# EAGLE design BinaryKeyboard (EAGLE 8.2.2)
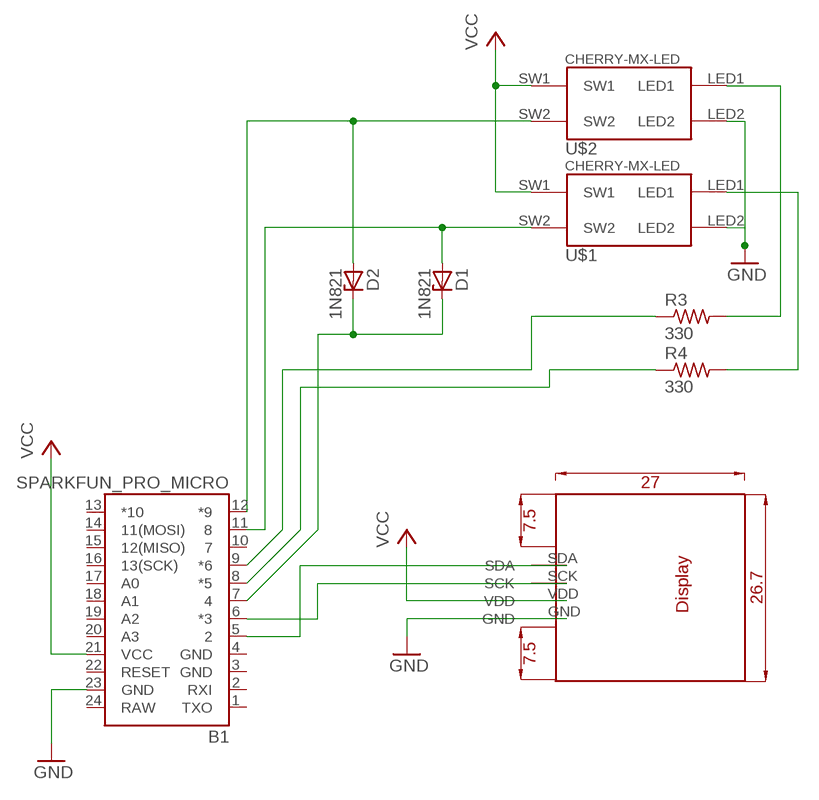
[diagram p0: schematic, sheet 1]

## Parts
B1  SPARKFUN_PRO_MICRO  [SPARKFUN_PRO_MICRO]
D1  1N821  [DO35Z10]
D2  1N821  [DO35Z10]
DISPLAY1  GM009605  [GM009605]
R3  330  R-US_0204/7  [0204/7]
R4  330  R-US_0204/7  [0204/7]
U$1  CHERRY-MX-LED  [CHERRY-MX-LED]
U$2  CHERRY-MX-LED  [CHERRY-MX-LED]

## Nets
GND: B1.23(GND) DISPLAY1.GND U$1.LED2 U$2.LED2
N$1: B1.11 D1.A U$1.SW2
N$2: B1.12(*9) D2.A U$2.SW2
N$3: B1.5 DISPLAY1.SDA
N$4: B1.6(*3) DISPLAY1.SCK
N$5: R3.2 U$2.LED1
N$6: R4.2 U$1.LED1
N$7: B1.9(*6) R3.1
N$8: B1.8(*5) R4.1
N$9: B1.7 D1.C D2.C
VCC: B1.21(VCC) DISPLAY1.VDD U$1.SW1 U$2.SW1
Unconnected: B1.1(TXO) B1.2(RXI) B1.10 B1.13(*10) B1.14(11(MOSI)) B1.15(12(MISO)) B1.16(13(SCK)) B1.17(A0) B1.18(A1) B1.19(A2) B1.20(A3) B1.22(RESET)

## Power pins joined to a net without a drawn wire
GND: B1.3(GND) B1.4(GND)
RAW: B1.24(RAW)

## Library data of the parts
B1 = SparkFun-Boards:SPARKFUN_PRO_MICRO: SparkFun Pro Micro Atmega32U4 compatible footprint. SparkFun Products: 3.3V/8MHz <https://www.sparkfun.com/products/12587> 5V/16MHz <https://www.sparkfun.com/products/12640>
D1 D2 = diode:1N821: Reference DIODE temperature compensated, 6,2 V
DISPLAY1 = CSJ Library:GM009605: GM009605 OLED Display
R3 R4 = resistor:R-US_: RESISTOR, American symbol
U$1 U$2 = cherrymx:CHERRY-MX-LED: Cherry MX series keyswitch with LED

## Net classes
0 default: width 0.305 mm

## Board
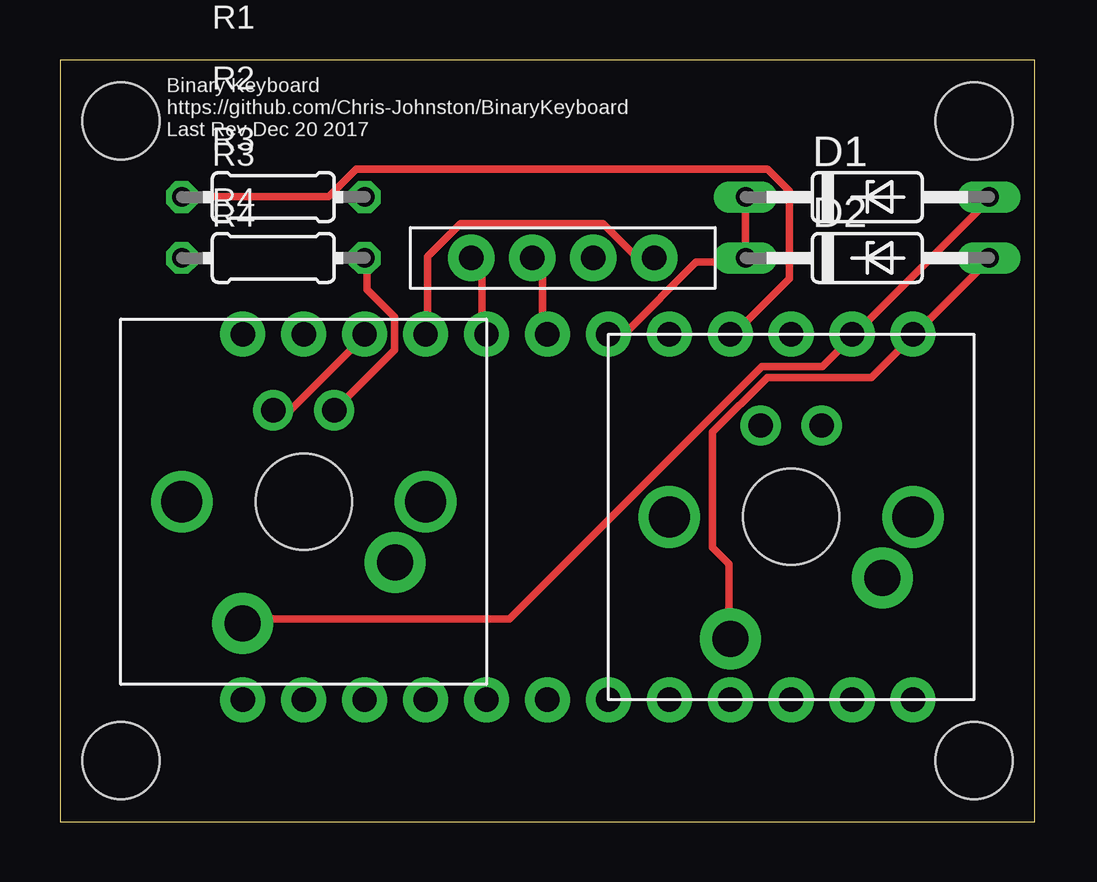
[diagram p1: board, top side]
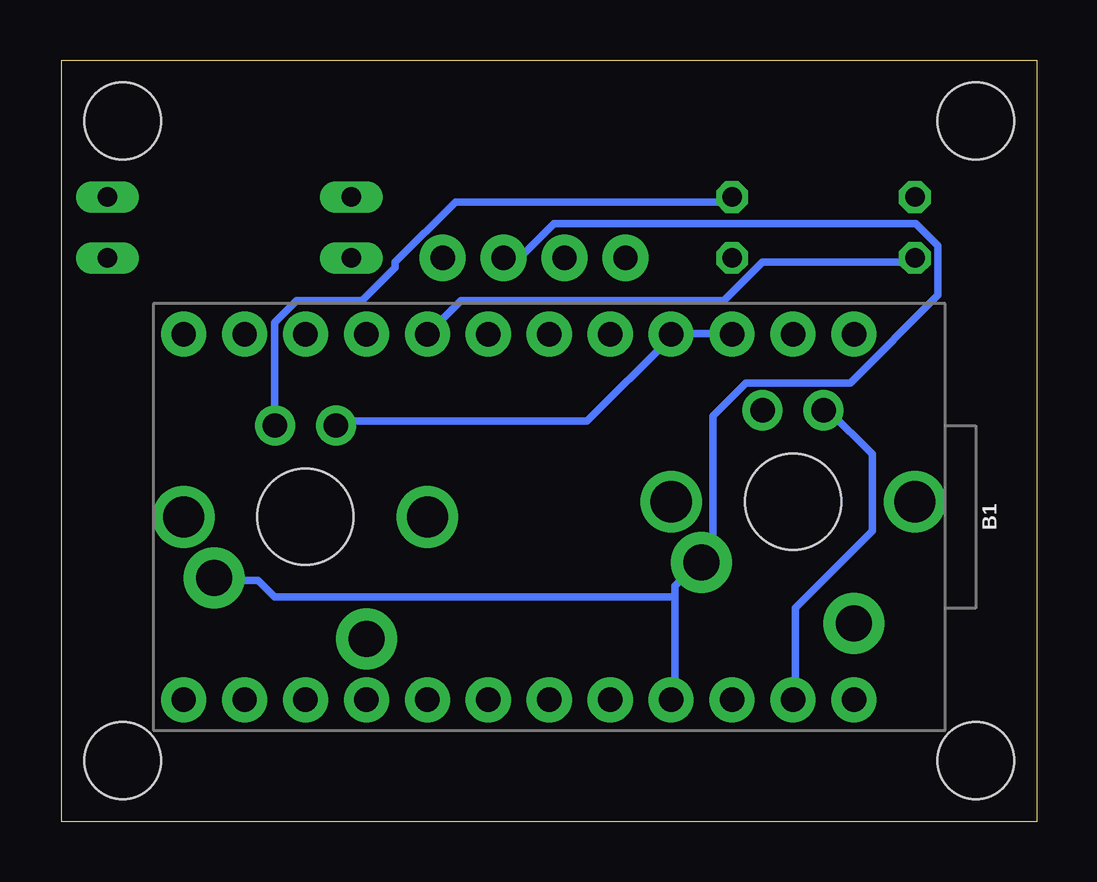
[diagram p2: board, bottom side, seen from below]

Size 40.64 x 31.75 mm. Coordinates in mm from the lower left corner, seen from the top.
Outline: 0,0 40.64,0 40.64,31.75 0,31.75 0,0
Copper layers (1*16): Top 0.035mm / dielectric 1.5mm / Bottom 0.035mm
Design rules "default": minimum track width 6mil, minimum drill 0.35mm, track to track 6mil, track to pad 6mil, pad to pad 6mil, via to via 6mil, smd to smd 6mil, copper to edge 40mil, drill to drill 6mil, minimum pad ring 10mil, minimum via ring 8mil, stop-mask expansion 4mil, vias tented up to drill 0mil, thermal gap 10mil
Holes 3.2 mm at 2.54,29.21 38.1,29.21 2.54,2.54 38.1,2.54

### Footprints (pad centres in the part's own frame; a part is rotated, then mirrored left to right if it is on the bottom)
SPARKFUN_PRO_MICRO = drill 1.016 pad 1.88: 1 -7.62,12.7; 2 -7.62,10.16; 3 -7.62,7.62; 4 -7.62,5.08; 5 -7.62,2.54; 6 -7.62,0; 7 -7.62,-2.54; 8 -7.62,-5.08; 9 -7.62,-7.62; 10 -7.62,-10.16; 11 -7.62,-12.7; 12 -7.62,-15.24; 13 7.62,-15.24; 14 7.62,-12.7; 15 7.62,-10.16; 16 7.62,-7.62; 17 7.62,-5.08; 18 7.62,-2.54; 19 7.62,0; 20 7.62,2.54; 21 7.62,5.08; 22 7.62,7.62; 23 7.62,10.16; 24 7.62,12.7
DO35Z10 = drill 0.813 long: A 5.08,0; C -5.08,0
GM009605 = drill 1.016 pad 1.93: GND 7.62,-1.27; SCK 2.54,-1.27; SDA 0,-1.27; VDD 5.08,-1.27
0204/7 = drill 0.813 octagon: 1 -3.81,0; 2 3.81,0
CHERRY-MX-LED = drill 1.016 pad 1.676: LED1 -1.27,-3.81; LED2 1.27,-3.81 | drill 1.714 pad 1.93: P$3 -5.08,0; P$4 5.08,0 | drill 1.5 pad 2.54: SW1 -3.81,2.54; SW2 2.54,5.08 | hole 4: 0,0

### Placement (x,y rotation side)
B1  20.32,12.7 270 bottom
D1  33.66,26.04 0 top
D2  33.66,23.5 0 top
DISPLAY1  17.14,24.77 0 top
R3  8.89,26.04 0 top
R4  8.89,23.5 0 top
U$1  10.16,13.34 180 top
U$2  30.48,12.7 180 top

### Tracks (layer width: path | path; a pad name or v marks a point on that pad's centre or on a via)
GND
  Top 0.305: U$1.LED2 9.6,17.14 12.57,20.12 B1.3 | DISPLAY1.GND 24.69,23.55 24,23.55 22.63,24.92 16.69,24.92 15.32,23.55 15.32,20.34 B1.4
  Bottom 0.305: B1.23 10.06,5.26 10.06,8.91 6.86,12.12 6.86,15.32 8.69,17.14 U$1.LED2 | U$2.LED2 29.03,16.69 18.75,16.69 15.32,20.12 B1.4 15.09,20.34 12.8,20.34 B1.3
N$1
  Top 0.305: D1.A 38.63,25.83 33.15,20.34 B1.11 32.92,20.12 31.77,18.97 29.26,18.97 18.75,8.46 7.77,8.46 U$1.SW2
N$2
  Top 0.305: D2.A 38.63,23.32 35.66,20.34 B1.12 35.43,20.12 33.83,18.52 29.49,18.52 27.2,16.23 27.2,11.43 27.89,10.74 27.89,7.77 U$2.SW2
N$3
  Top 0.305: B1.5 17.6,20.34 17.6,22.86 17.14,23.32 DISPLAY1.SDA
N$4
  Top 0.305: B1.6 20.12,20.34 20.12,23.09 19.89,23.32 DISPLAY1.SCK
N$5
  Bottom 0.305: R3.2 12.8,25.83 24.23,25.83 26.75,23.32 26.75,23.09 28.12,21.72 30.86,21.72 31.77,20.8 31.77,16.69 U$2.LED1
N$6
  Top 0.305: U$1.LED1 13.95,19.66 13.95,21.03 12.8,22.17 12.8,23.32 R4.2
N$7
  Top 0.305: R3.1 5.26,26.06 11.2,26.06 12.34,27.2 29.49,27.2 30.4,26.29 30.4,22.63 28.12,20.34 B1.9
N$8
  Bottom 0.305: B1.8 24,21.72 13.03,21.72 11.43,23.32 5.26,23.32 R4.1
N$9
  Top 0.305: D1.C D2.C 28.57,23.32 26.52,23.32 23.55,20.34 22.86,20.34 B1.7
VCC
  Bottom 0.305: 15.09,9.37 15.09,9.83 14.17,10.74 U$1.SW1 13.95,10.97 13.49,11.43 13.49,16.92 12.12,18.29 7.77,18.29 4.12,21.95 4.12,24 5.03,24.92 20.12,24.92 21.49,23.55 22.17,23.55 DISPLAY1.VDD | 15.09,9.37 15.09,5.26 B1.21 | 15.09,9.37 31.77,9.37 32.46,10.06 34.29,10.06 U$2.SW1

### Text on the board
tPlace: Binary Keyboard / https://github.com/Chris-Johnston/BinaryKeyboard / Last Rev Dec 20 2017
_tNames: B1 | R1 | R2 | R3 | R4